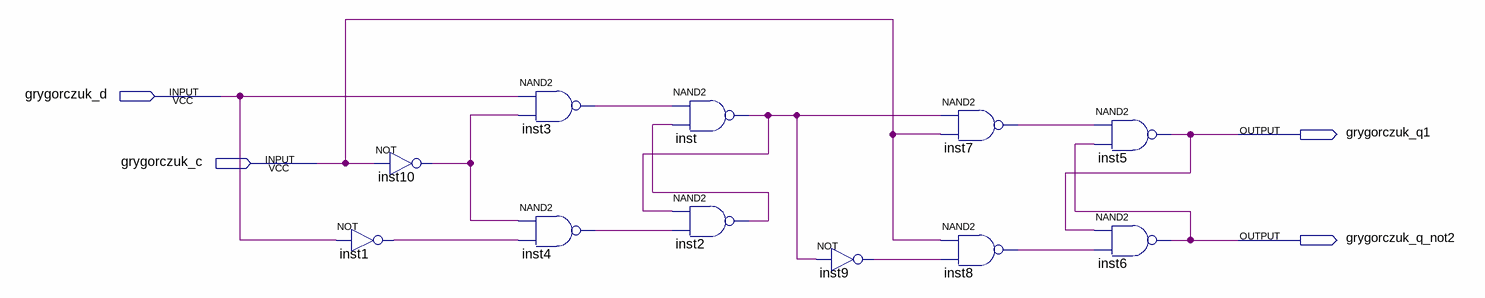
[diagram p0: schematic sheet]
// Quartus schematic MASTER_SLAVE_D_FLIP_FLOP.bdf as structural Verilog: 11 symbols, 4 pins
module MASTER_SLAVE_D_FLIP_FLOP (
  input  grygorczuk_d,
  input  grygorczuk_c,
  output grygorczuk_q1,
  output grygorczuk_q_not2
);

  wire inst1_out, inst2_out, inst3_out, inst4_out, inst7_out, inst8_out, inst9_out, inst10_out, inst_out;

  not inst1 (inst1_out, grygorczuk_d);
  not inst10 (inst10_out, grygorczuk_c);
  nand inst3 (inst3_out, grygorczuk_d, inst10_out);
  nand inst4 (inst4_out, inst10_out, inst1_out);
  nand inst (inst_out, inst3_out, inst2_out);
  nand inst2 (inst2_out, inst_out, inst4_out);
  not inst9 (inst9_out, inst_out);
  nand inst7 (inst7_out, inst_out, grygorczuk_c);
  nand inst8 (inst8_out, grygorczuk_c, inst9_out);
  nand inst5 (grygorczuk_q1, inst7_out, grygorczuk_q_not2);
  nand inst6 (grygorczuk_q_not2, grygorczuk_q1, inst8_out);
endmodule
